# Altium schematic sheet P03_Processor 2 or 3, USB and Serial.SchDoc
size A
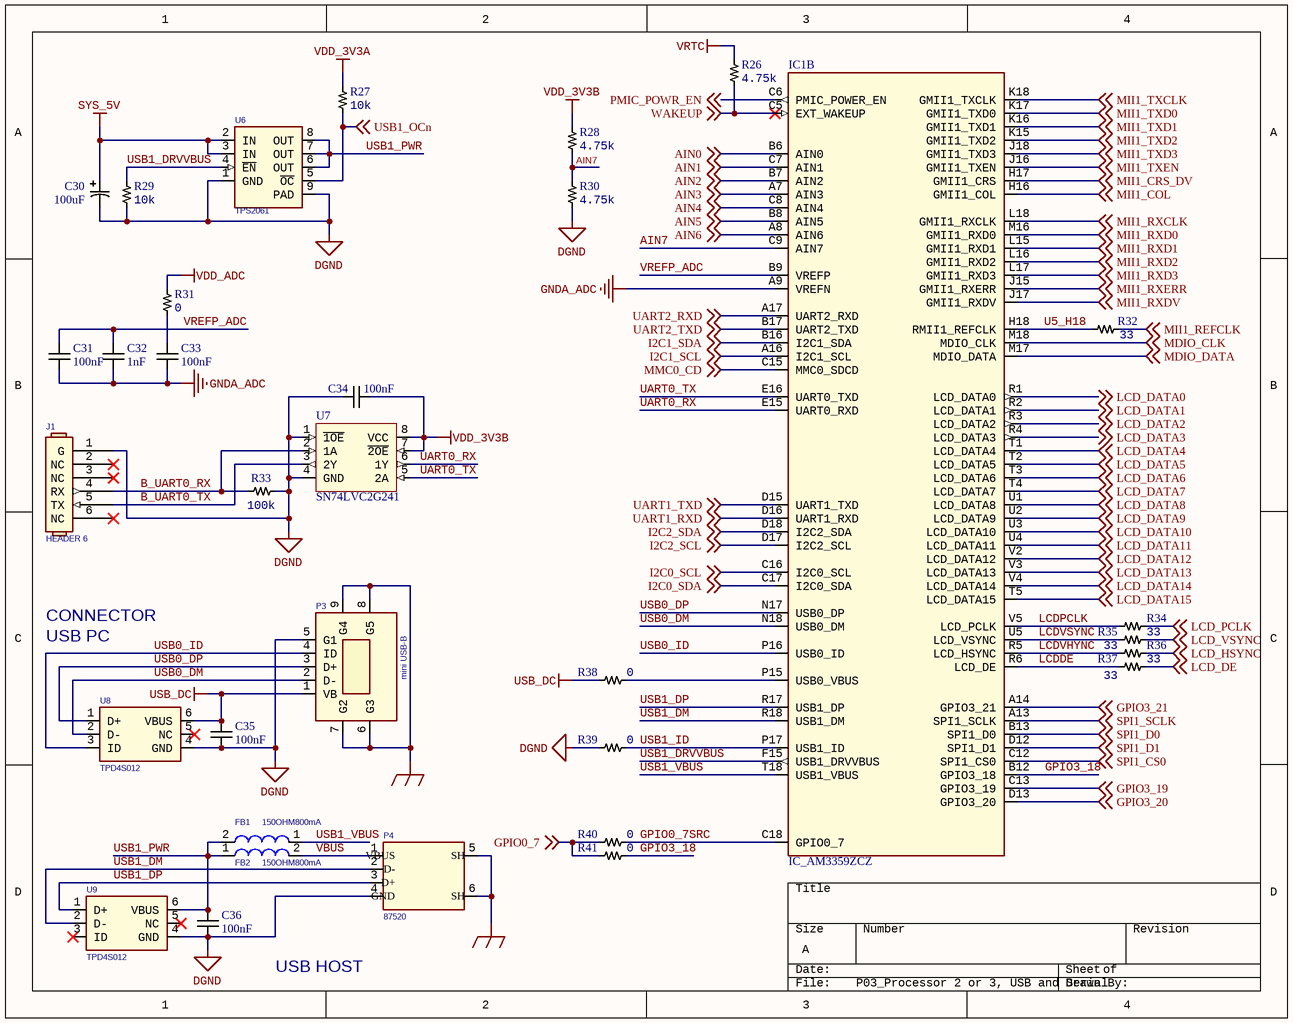
[diagram p0: P03_Processor 2 or 3, USB and Serial.SchDoc]

## Parts
C30  Capacitance: 100uF  [CAP6.6x6.6]  (hidden comment: EEE-0JA101SP)
C31  Capacitance: 100nF  [CAP0402]  (hidden comment: C0402C104K4RACTU)
C32  Capacitance: 1nF  [CAP0402]  (hidden comment: CC0402KRX7R9BB102)
C33  Capacitance: 100nF  [CAP0402]  (hidden comment: C0402C104K4RACTU)
C34  Capacitance: 100nF  [CAP0402]  (hidden comment: C0402C104K4RACTU)
C35  Capacitance: 100nF  [CAP0402]  (hidden comment: C0402C104K4RACTU)
C36  Capacitance: 100nF  [CAP0402]  (hidden comment: C0402C104K4RACTU)
FB1  150OHM800mA  [FB0805]
FB2  150OHM800mA  [FB0805]
IC1  IC_AM3359ZCZ  [BGA-324]  (part B of 5)
J1  HEADER 6  [SIP6]
P3  mini USB-B  [USB5MINI_4SHIELDED_SMD-5]
P4  87520  [USB_A]
R26  Resistance: 4.75k  [RES0402]  (hidden comment: RC0402FR-074K75L)
R27  Resistance: 10k  [RES0402]  (hidden comment: RC0402FR-0710KL)
R28  Resistance: 4.75k  [RES0402]  (hidden comment: RC0402FR-074K75L)
R29  Resistance: 10k  [RES0402]  (hidden comment: RC0402FR-0710KL)
R30  Resistance: 4.75k  [RES0402]  (hidden comment: RC0402FR-074K75L)
R31  Resistance: 0  [RES0402]  (hidden comment: RC0402JR-070RL)
R32  Resistance: 33  [RES0402]  (hidden comment: RC0402FR-0733RL)
R33  Resistance: 100k  [RES0402]  (hidden comment: RC0402FR-07100KL)
R34  Resistance: 33  [RES0402]  (hidden comment: RC0402FR-0733RL)
R35  Resistance: 33  [RES0402]  (hidden comment: RC0402FR-0733RL)
R36  Resistance: 33  [RES0402]  (hidden comment: RC0402FR-0733RL)
R37  Resistance: 33  [RES0402]  (hidden comment: RC0402FR-0733RL)
R38  Resistance: 0  [RES0402]  (hidden comment: RC0402JR-070RL)
R39  Resistance: 0  [RES0402]  (hidden comment: RC0402JR-070RL)
R40  Resistance: 0  [RES0402]  (hidden comment: RC0402JR-070RL)
R41  Resistance: 0  [RES0402]  (hidden comment: RC0402JR-070RL)
U6  TPS2061  [HVSSOP-8]
U7  SN74LVC2G241  [VSSOP-8]
U8  TPD4S012  [U_6_DRY]
U9  TPD4S012  [U_6_DRY]

## Nets
DGND: C30.2(C) C34.1 C35.2 C36.2 J1.1(G) P3.5(G1) P4.4(P4) R29.2 R30.1 R33.1 R39.1 U6.1(GND) U6.9(PAD) U7.1(~{1OE}) U7.4(GND) U8.4(GND) U9.4(GND)
GND_EARTH: P3.6(G3) P3.7(G2) P3.8(G5) P3.9(G4) P4.5(SHELD1) P4.6(PAD4)
GNDA_ADC: C31.2 C32.2 C33.2 IC1.A9(VREFN)
SYS_5V: C30.1(A) U6.2(IN) U6.3(IN)
USB_DC: C35.1 P3.1(VB) R38.1 U8.6(VBUS)
VDD_3V3A: R27.1
VDD_3V3B: C34.2 R28.2 U7.7(~{2OE}) U7.8(VCC)
VDD_ADC: R31.2
VRTC: R26.2
AIN0: IC1.B6(AIN0) ; off-sheet AIN0
AIN1: IC1.C7(AIN1) ; off-sheet AIN1
AIN2: IC1.B7(AIN2) ; off-sheet AIN2
AIN3: IC1.A7(AIN3) ; off-sheet AIN3
AIN4: IC1.C8(AIN4) ; off-sheet AIN4
AIN5: IC1.B8(AIN5) ; off-sheet AIN5
AIN6: IC1.A8(AIN6) ; off-sheet AIN6
AIN7: IC1.C9(AIN7) R28.1 R30.2
B_UART0_RX: J1.4(RX) R33.2 U7.2(1A)
B_UART0_TX: J1.5(TX) U7.3(2Y)
GPIO0_7: R40.2 R41.1 ; off-sheet GPIO0_7
GPIO0_7SRC: IC1.C18(GPIO0_7) R40.1
GPIO3_18: IC1.B12(GPIO3_18) R41.2
GPIO3_19: IC1.C13(GPIO3_19) ; off-sheet GPIO3_19
GPIO3_20: IC1.D13(GPIO3_20) ; off-sheet GPIO3_20
GPIO3_21: IC1.A14(GPIO3_21) ; off-sheet GPIO3_21
I2C0_SCL: IC1.C16(I2C0_SCL) ; off-sheet I2C0_SCL
I2C0_SDA: IC1.C17(I2C0_SDA) ; off-sheet I2C0_SDA
I2C1_SCL: IC1.A16(I2C1_SCL) ; off-sheet I2C1_SCL
I2C1_SDA: IC1.B16(I2C1_SDA) ; off-sheet I2C1_SDA
I2C2_SCL: IC1.D17(I2C2_SCL) ; off-sheet I2C2_SCL
I2C2_SDA: IC1.D18(I2C2_SDA) ; off-sheet I2C2_SDA
LCD_DATA0: IC1.R1(LCD_DATA0) ; off-sheet LCD_DATA0
LCD_DATA1: IC1.R2(LCD_DATA1) ; off-sheet LCD_DATA1
LCD_DATA2: IC1.R3(LCD_DATA2) ; off-sheet LCD_DATA2
LCD_DATA3: IC1.R4(LCD_DATA3) ; off-sheet LCD_DATA3
LCD_DATA4: IC1.T1(LCD_DATA4) ; off-sheet LCD_DATA4
LCD_DATA5: IC1.T2(LCD_DATA5) ; off-sheet LCD_DATA5
LCD_DATA6: IC1.T3(LCD_DATA6) ; off-sheet LCD_DATA6
LCD_DATA7: IC1.T4(LCD_DATA7) ; off-sheet LCD_DATA7
LCD_DATA8: IC1.U1(LCD_DATA8) ; off-sheet LCD_DATA8
LCD_DATA9: IC1.U2(LCD_DATA9) ; off-sheet LCD_DATA9
LCD_DATA10: IC1.U3(LCD_DATA10) ; off-sheet LCD_DATA10
LCD_DATA11: IC1.U4(LCD_DATA11) ; off-sheet LCD_DATA11
LCD_DATA12: IC1.V2(LCD_DATA12) ; off-sheet LCD_DATA12
LCD_DATA13: IC1.V3(LCD_DATA13) ; off-sheet LCD_DATA13
LCD_DATA14: IC1.V4(LCD_DATA14) ; off-sheet LCD_DATA14
LCD_DATA15: IC1.T5(LCD_DATA15) ; off-sheet LCD_DATA15
LCD_DE: R37.2 ; off-sheet LCD_DE
LCD_HSYNC: R36.2 ; off-sheet LCD_HSYNC
LCD_PCLK: R34.2 ; off-sheet LCD_PCLK
LCD_VSYNC: R35.2 ; off-sheet LCD_VSYNC
LCDDE: IC1.R6(LCD_DE) R37.1
LCDPCLK: IC1.V5(LCD_PCLK) R34.1
LCDVHYNC: IC1.R5(LCD_HSYNC) R36.1
LCDVSYNC: IC1.U5(LCD_VSYNC) R35.1
MDIO_CLK: IC1.M18(MDIO_CLK) ; off-sheet MDIO_CLK
MDIO_DATA: IC1.M17(MDIO_DATA) ; off-sheet MDIO_DATA
MII1_COL: IC1.H16(GMII1_COL) ; off-sheet MII1_COL
MII1_CRS_DV: IC1.H17(GMII1_CRS) ; off-sheet MII1_CRS_DV
MII1_REFCLK: R32.2 ; off-sheet MII1_REFCLK
MII1_RXCLK: IC1.L18(GMII1_RXCLK) ; off-sheet MII1_RXCLK
MII1_RXD0: IC1.M16(GMII1_RXD0) ; off-sheet MII1_RXD0
MII1_RXD1: IC1.L15(GMII1_RXD1) ; off-sheet MII1_RXD1
MII1_RXD2: IC1.L16(GMII1_RXD2) ; off-sheet MII1_RXD2
MII1_RXD3: IC1.L17(GMII1_RXD3) ; off-sheet MII1_RXD3
MII1_RXDV: IC1.J17(GMII1_RXDV) ; off-sheet MII1_RXDV
MII1_RXERR: IC1.J15(GMII1_RXERR) ; off-sheet MII1_RXERR
MII1_TXCLK: IC1.K18(GMII1_TXCLK) ; off-sheet MII1_TXCLK
MII1_TXD0: IC1.K17(GMII1_TXD0) ; off-sheet MII1_TXD0
MII1_TXD1: IC1.K16(GMII1_TXD1) ; off-sheet MII1_TXD1
MII1_TXD2: IC1.K15(GMII1_TXD2) ; off-sheet MII1_TXD2
MII1_TXD3: IC1.J18(GMII1_TXD3) ; off-sheet MII1_TXD3
MII1_TXEN: IC1.J16(GMII1_TXEN) ; off-sheet MII1_TXEN
MMC0_CD: IC1.C15(MMC0_SDCD) ; off-sheet MMC0_CD
PMIC_POWR_EN: IC1.C6(PMIC_POWER_EN) ; off-sheet PMIC_POWR_EN
SPI1_CS0: IC1.C12(SPI1_CS0) ; off-sheet SPI1_CS0
SPI1_D0: IC1.B13(SPI1_D0) ; off-sheet SPI1_D0
SPI1_D1: IC1.D12(SPI1_D1) ; off-sheet SPI1_D1
SPI1_SCLK: IC1.A13(SPI1_SCLK) ; off-sheet SPI1_SCLK
U5_H18: IC1.H18(RMII1_REFCLK) R32.1
UART0_RX: IC1.E15(UART0_RXD) U7.6(1Y)
UART0_TX: IC1.E16(UART0_TXD) U7.5(2A)
UART1_RXD: IC1.D16(UART1_RXD) ; off-sheet UART1_RXD
UART1_TXD: IC1.D15(UART1_TXD) ; off-sheet UART1_TXD
UART2_RXD: IC1.A17(UART2_RXD) ; off-sheet UART2_RXD
UART2_TXD: IC1.B17(UART2_TXD) ; off-sheet UART2_TXD
USB0_DM: IC1.N18(USB0_DM) P3.2(D-) U8.2(D-)
USB0_DP: IC1.N17(USB0_DP) P3.3(D+) U8.1(D+)
USB0_ID: IC1.P16(USB0_ID) P3.4(ID) U8.3(ID)
USB1_DM: IC1.R18(USB1_DM) P4.2(P2) U9.2(D-)
USB1_DP: IC1.R17(USB1_DP) P4.3(P3) U9.1(D+)
USB1_DRVVBUS: IC1.F15(USB1_DRVVBUS) R29.1 U6.4(~{EN})
USB1_ID: IC1.P17(USB1_ID) R39.2
USB1_OCn: R27.2 U6.5(~{OC}) ; off-sheet USB1_OCn
USB1_PWR: C36.1 FB1.2 FB2.1 U6.6(OUT) U6.7(OUT) U6.8(OUT) U9.6(VBUS)
USB1_VBUS: FB1.1 IC1.T18(USB1_VBUS)
VBUS: FB2.2 P4.1(P1)
VREFP_ADC: C31.1 C32.1 IC1.B9(VREFP)
WAKEUP: IC1.C5(EXT_WAKEUP) R26.1 ; off-sheet WAKEUP
NetC33_1: C33.1 R31.1
NetIC1_P15: IC1.P15(USB0_VBUS) R38.2

Not connected (* = marked no-connect by the designer): J1 2(NC)* 3(NC)* 6(NC)*; U8 5(NC)*; U9 3(ID)* 5(NC)*

## Notes on the sheet
- USB PC
- CONNECTOR
- USB HOST
- Title
- Size:
- Date:
- A
- Number:
- Time:
- Revision:
- Sheet
- of
- File:
- (in symbol CONN_USBA) VBUS; SH; D-; D+; GND

## Library data of the parts
C30 = CAP_POL_100uF: POL CAP 100uF SMD; Manufacturer: Panasonic; Dielectric Material: Aluminium; Ripple Current: 71mA; Tolerance: 20%; Voltage Rating: 6.3V; Life (Hours): 2000Hour; Leakage Current: 3uA; Lead Length: 2.6mm; Supplier 1: Digi-Key; Manufacturer Part Number: EEE-0JA101SP; Stock 1: 67789; Pricing 1: 1=0.35000, 10=0.24000, 100=0.14420, 500=0.10816 (USD); RoHS: Yes; Mount: Surface Mount,PCB; Case/Package: Radial; Number of Pins: 2; Contact Plating: Tin; Min Operating Temperature: -40°C; Max Operating Temperature: 85°C; Ripple Current (AC): 71mA; Packaging: Tape and Reel; Voltage Rating (DC): 6.3V; Package Quantity: 1; Termination: SMD/SMT; Voltage: 6.3V; Features: General Purpose; Diameter: 6.3mm; Length: 5.5mm; Height: 5.4mm; Height - Seated (Max): 0.213inch; Width: 6.6mm; Lead Pitch: 2.2mm; Radiation Hardening: No; REACH SVHC: No SVHC; Lead Free: Lead Free; ComponentLink1URL: https://datasheet.ciiva.com/11779/0900766b8078636e-11779744.pdf?src-supplier=RSComponents; ComponentLink1Description: https://datasheet.ciiva.com/11779/0900766b8078636e-11779744.pdf?src-supplier=RSComponents; ComponentLink2URL: https://datasheet.ciiva.com/14610/70255710-14610022.pdf?src-supplier=Allied+Electronics; ComponentLink2Description: https://datasheet.ciiva.com/14610/70255710-14610022.pdf?src-supplier=Allied+Electronics; ComponentLink3URL: https://datasheet.ciiva.com/30226/11aba0000ce2-30226184.pdf?src-supplier=Onlinecomponents.com; ComponentLink3Description: https://datasheet.ciiva.com/30226/11aba0000ce2-30226184.pdf?src-supplier=Onlinecomponents.com; ComponentLink4URL: https://datasheet.ciiva.com/16397/aba0000ce2-16397066.pdf?src-supplier=Future+Electronics; ComponentLink4Description: https://datasheet.ciiva.com/16397/aba0000ce2-16397066.pdf?src-supplier=Future+Electronics; ComponentLink5URL: https://datasheet.ciiva.com/46387/aba0000ce2-46387964.pdf?src-supplier=Element14; ComponentLink5Description: https://datasheet.ciiva.com/46387/aba0000ce2-46387964.pdf?src-supplier=Element14; ComponentLink6URL: https://datasheet.ciiva.com/14595/70255710-14595757.pdf?src-supplier=Allied+Electronics; ComponentLink6Description: https://datasheet.ciiva.com/14595/70255710-14595757.pdf?src-supplier=Allied+Electronics; ComponentLink7URL: https://datasheet.ciiva.com/2983/aba0000ce2-2983902.pdf?src-supplier=Avnet; ComponentLink7Description: https://datasheet.ciiva.com/2983/aba0000ce2-2983902.pdf?src-supplier=Avnet; ComponentLink8URL: https://datasheet.ciiva.com/43485/aba0000ce2-43485605.pdf?src-supplier=Farnell; ComponentLink8Description: https://datasheet.ciiva.com/43485/aba0000ce2-43485605.pdf?src-supplier=Farnell; ComponentLink9URL: https://datasheet.ciiva.com/24070/aba0000ce2-40801-24070230.pdf?src-supplier=Mouser; ComponentLink9Description: https://datasheet.ciiva.com/24070/aba0000ce2-40801-24070230.pdf?src-supplier=Mouser; ComponentLink10URL: https://datasheet.ciiva.com/46376/aba0000ce2-46376375.pdf?src-supplier=Element14; ComponentLink10Description: https://datasheet.ciiva.com/46376/aba0000ce2-46376375.pdf?src-supplier=Element14; ComponentLink11URL: https://datasheet.ciiva.com/6134/aba0000ce2-6134361.pdf?src-supplier=Farnell; ComponentLink11Description: https://datasheet.ciiva.com/6134/aba0000ce2-6134361.pdf?src-supplier=Farnell; ComponentLink12URL: https://datasheet.ciiva.com/16539/aba0000ce2-16539929.pdf?src-supplier=Avnet+Asia; ComponentLink12Description: https://datasheet.ciiva.com/16539/aba0000ce2-16539929.pdf?src-supplier=Avnet+Asia; ComponentLink13URL: https://datasheet.ciiva.com/15165/getdatasheetpartid-73778-15165850.pdf?src-supplier=Verical; ComponentLink13Description: https://datasheet.ciiva.com/15165/getdatasheetpartid-73778-15165850.pdf?src-supplier=Verical; ComponentLink14URL: https://datasheet.ciiva.com/17353/aba0000ce2-17353295.pdf?src-supplier=Avnet+Europe; ComponentLink14Description: https://datasheet.ciiva.com/17353/aba0000ce2-17353295.pdf?src-supplier=Avnet+Europe; Supplier Part Number 1: PCE3852CT-ND
C31 C33-C36 = CAP_100nF: MLCC 100nF 0402 SMD; Manufacturer: KEMET; Tolerance: 10%; Voltage Rating (DC): 16V; Dielectric: X7R; Dissipation Factor: 3.5%; Supplier 1: Digi-Key; Supplier Part Number 1: 399-3521-1-ND; Manufacturer Part Number: C0402C104K4RACTU; RoHS: Yes; Stock 1: 6512243; Pricing 1: 1=0.10000, 10=0.04200, 100=0.01860, 500=0.01328, 1000=0.01044, 2500=0.00949, 5000=0.00873 (USD); Packaging: Tape and Reel; Mount: Surface Mount; Case/Package: 0402; Case Code (Imperial): 0402; Case Code (Metric): 1005; Contact Plating: Tin,Matte; Min Operating Temperature: -55°C; Max Operating Temperature: 125°C; Package Quantity: 10000; Voltage Rating: 16V; Termination: SMD/SMT; Length: 1mm; Height: 0.5mm; Width: 0.5mm; Depth: 0.5mm; Radiation Hardening: No; ComponentLink2URL: https://datasheet.ciiva.com/18192/getdatasheetpartid-385384-18192412.pdf?src-supplier=Verical; ComponentLink2Description: Datasheet
C32 = CAP_1nF: MLCC 1nF 0402 SMD; Manufacturer: Yageo; Tolerance: 10%; Dielectric Material: Ceramic; Voltage Rating: 50V; Insulation Resistance: 100GR; Supplier 1: Digi-Key; Manufacturer Part Number: CC0402KRX7R9BB102; RoHS: Yes; Stock 1: 3539064; Pricing 1: 1=0.10000, 10=0.02100, 100=0.00920, 500=0.00654, 1000=0.00514, 2500=0.00468, 5000=0.00430 (USD); Packaging: Tape and Reel; ComponentLink1URL: https://datasheet.ciiva.com/11786/0900766b8079c870-11786157.pdf?src-supplier=RSComponents; ComponentLink1Description: https://datasheet.ciiva.com/11786/0900766b8079c870-11786157.pdf?src-supplier=RSComponents; Mount: Surface Mount; Case/Package: 0402; Case Code (Metric): 1005; Case Code (Imperial): 0402; Min Operating Temperature: -55°C; Max Operating Temperature: 125°C; Length: 0.039inch; Width: 0.02inch; Thickness: 0.022inch; Lead Free: Lead Free; Halogen Free: Halogen Free; ComponentLink2URL: https://datasheet.ciiva.com/143/mlccorderingcode-143956.pdf?src-supplier=Digi-Key; ComponentLink2Description: https://datasheet.ciiva.com/143/mlccorderingcode-143956.pdf?src-supplier=Digi-Key; ComponentLink3URL: https://datasheet.ciiva.com/143/mlccorderingcode-143957.pdf?src-supplier=Digi-Key; ComponentLink3Description: https://datasheet.ciiva.com/143/mlccorderingcode-143957.pdf?src-supplier=Digi-Key; ComponentLink4URL: https://datasheet.ciiva.com/143/mlccorderingcode-143958.pdf?src-supplier=Digi-Key; ComponentLink4Description: https://datasheet.ciiva.com/143/mlccorderingcode-143958.pdf?src-supplier=Digi-Key; ComponentLink5URL: https://datasheet.ciiva.com/13389/upy-gp-np0-16v-to-50v-8-13389974.pdf?src-supplier=Mouser; ComponentLink5Description: https://datasheet.ciiva.com/13389/upy-gp-np0-16v-to-50v-8-13389974.pdf?src-supplier=Mouser; ComponentLink6URL: https://datasheet.ciiva.com/16625/upy-gphc-x7r-6-3v-to-50v-8-16625512.pdf?src-supplier=Avnet+Europe; ComponentLink6Description: https://datasheet.ciiva.com/16625/upy-gphc-x7r-6-3v-to-50v-8-16625512.pdf?src-supplier=Avnet+Europe; ComponentLink7URL: https://datasheet.ciiva.com/15189/getdatasheetpartid-403474-15189131.pdf?src-supplier=Verical; ComponentLink7Description: https://datasheet.ciiva.com/15189/getdatasheetpartid-403474-15189131.pdf?src-supplier=Verical; ComponentLink8URL: https://datasheet.ciiva.com/7978/1489800-7978092.pdf?src-supplier=Element14; ComponentLink8Description: https://datasheet.ciiva.com/7978/1489800-7978092.pdf?src-supplier=Element14; ComponentLink9URL: https://datasheet.ciiva.com/22749/1489800-22749213.pdf?src-supplier=Element14; ComponentLink9Description: https://datasheet.ciiva.com/22749/1489800-22749213.pdf?src-supplier=Element14
FB1 = FERR: FERRITE 800MA 150 OHM 0805 SMD; Manufacturer: Laird-Signal Integrity Products; Manufacturer Part Number: LI0805H151R-10; PartName: FerriteBead150ohm800mA; Mfr: Steward; TIIntPartnumber: 1L0010; Vendor: Digikey; Impedance @ Frequency: 150 Ohm @ 100MHz; DC Resistance (DCR): 150 mOhm Max; Filter Type: Differential Mode - Single; Supplier 1: Digi-Key; Supplier Part Number 1: 240-2384-6-ND; RoHS: RoHS Compliant; Category: Filters; Stock 1: 3694; Pricing 1: 1=0.1, 10=0.07, 25=0.064, 50=0.0574, 100=0.0421, 250=0.03064, 500=0.02808, 1000=0.02424 (USD); Package / Case: 0805 (2012 Metric); Size / Dimension: 0.079" L x 0.049" W (2.00mm x 1.25mm); Packaging: Digi-Reel®; ComponentLink1URL: http://www.lairdtech.com/WorkArea/linkit.aspx?LinkIdentifier=id&ItemID=4912; ComponentLink1Description: http://www.lairdtech.com/WorkArea/linkit.aspx?LinkIdentifier=id&ItemID=4912; MfrNum: LI0805H151R-10; Current Rating: 800mA; Mounting Type: Surface Mount; Height (Max): 0.043" (1.10mm)
FB2 = FERR: FERRITE 800MA 150 OHM 0805 SMD; PartName: FerriteBead150ohm800mA; Mfr: Steward; MfrNum: LI0805H151R-10; TIIntPartnumber: 1L0010; Manufacturer: Laird-Signal Integrity Products; Vendor: Digikey; Impedance @ Frequency: 150 Ohm @ 100MHz; DC Resistance (DCR): 150 mOhm Max; Filter Type: Differential Mode - Single; Supplier 1: Digi-Key; Supplier Part Number 1: 240-2384-6-ND; Manufacturer Part Number: LI0805H151R-10; RoHS: RoHS Compliant; Category: Filters; Stock 1: 3694; Pricing 1: 1=0.1, 10=0.07, 25=0.064, 50=0.0574, 100=0.0421, 250=0.03064, 500=0.02808, 1000=0.02424 (USD); Current Rating: 800mA; Package / Case: 0805 (2012 Metric); Mounting Type: Surface Mount; Packaging: Digi-Reel®; Height (Max): 0.043" (1.10mm); Size / Dimension: 0.079" L x 0.049" W (2.00mm x 1.25mm); ComponentLink1URL: http://www.lairdtech.com/WorkArea/linkit.aspx?LinkIdentifier=id&ItemID=4912; ComponentLink1Description: http://www.lairdtech.com/WorkArea/linkit.aspx?LinkIdentifier=id&ItemID=4912
IC1 = IC_AM335X_ZCE_1: SubArctic Cortex A8 Processor 18x18; Manufacturer: Texas Instruments; Manufacturer Part Number: XAM3359ZCZ; Processor Type: ARM Microprocessor; Voltage: 1.06 V ~ 1.15 V; Supplier 1: Digi-Key; Supplier Part Number 1: 296-35073-ND; RoHS: RoHS Compliant; Category: Integrated Circuits (ICs); Stock 1: 16; Pricing 1: 1=33.5, 10=30.988, 100=26.465, 250=24.28752, 500=23.115, 1000=21.775, 2500=21.105, 5000=20.6025, 10000=20.1 (USD); Features: -; Speed: -; Mounting Type: Surface Mount; Package / Case: 324-LFBGA; Supplier Device Package: 324-NFBGA(15x15); Packaging: Tray; ComponentLink1URL: http://www.ti.com/lit/ds/symlink/am3354.pdf; ComponentLink1Description: http://www.ti.com/lit/ds/symlink/am3354.pdf
J1 = HDR_6x1: CONN HEADER 6POS, VERTICAL,  .100 STR TIN; Manufacturer: Samtec Inc; Manufacturer Part Number: FTR-110-03-G-D-06; Connector Type: Unshrouded; Number of Positions: 20; Number of Positions Loaded: 19; Pitch: 0.050" (1.27mm); Row Spacing: 0.100" (2.54mm); Supplier 1: Digi-Key; Supplier Part Number 1: FTR-110-03-G-D-06-ND; RoHS: RoHS Compliant; Category: Connectors, Interconnects; Stock 1: 0; Pricing 1: 1=4.47 (USD); Number of Rows: 2; Contact Mating Length: 0.125" (3.18mm); Mounting Type: Surface Mount; Termination: Solder; Features: -; Contact Finish: Gold; Contact Finish Thickness: 10µin (0.25µm); Color: Black; Packaging: Tube; ComponentLink1URL: http://www.samtec.com/documents/webfiles/cpdf/FTR-1XX-XX-XX-D-X-XX-MKT.pdf; ComponentLink1Description: http://www.samtec.com/documents/webfiles/cpdf/FTR-1XX-XX-XX-D-X-XX-MKT.pdf; Height Stacking (Mating): -; Molding Height Above Board: 0.100" (2.54mm)
P3 = MINI-USB-AB-SOCKET: CONN RCPT USB MINI B R/A SMD; Manufacturer: KYCON; Manufacturer Part Number: 0565790576; Order# 2: C-440247; ATLStockNo1: 4500.0223; Order#: KMAB-SMT-5S-S-30TR; Connector Type: USB - mini AB; Number of Contacts: 5; Gender: Receptacle; Specifications: USB 2.0 OTG; Manufacturer 2: AMP; Distributor: Deltron; Distributor 2: Tyco; Supplier 1: Digi-Key; Supplier Part Number 1: WM17122DKR-ND; RoHS: RoHS Compliant; Category: Connectors, Interconnects; Stock 1: 12426; Pricing 1: 1=2.92, 10=2.649, 25=2.4872, 50=2.3792, 100=2.271, 250=2.05468 (USD); Mounting Type: Surface Mount, Right Angle, Horizontal; Features: Shielded; Packaging: Digi-Reel®; Ingress Protection: -; ComponentLink1URL: http://www.molex.com/pdm_docs/sd/565790576_sd.pdf; ComponentLink1Description: http://www.molex.com/pdm_docs/sd/565790576_sd.pdf
P4 = CONN_USBA: CONN RCPT USB TYPE A R/A PCB; Manufacturer: FCI; Manufacturer Part Number: 87520-0010BLF; CLASS: IO; TN: 224-0234-000; Connector Type: USB - A; Number of Contacts: 4; Gender: Receptacle; Specifications: USB 2.0; Supplier 1: Digi-Key; Supplier Part Number 1: 609-1045-ND; RoHS: RoHS Compliant; Category: Connectors, Interconnects; Stock 1: 4363; Pricing 1: 1=0.78, 10=0.734, 25=0.6604, 50=0.587, 100=0.5626, 250=0.51368, 500=0.4892, 1000=0.40359, 2500=0.3669 (USD); Mounting Type: Through Hole, Right Angle, Horizontal; Features: Board Lock; Packaging: Tube; Ingress Protection: -; ComponentLink1URL: http://portal.fciconnect.com/Comergent//fci/drawing/87520.pdf; ComponentLink1Description: http://portal.fciconnect.com/Comergent//fci/drawing/87520.pdf
R26 R28 R30 = RES_4.75k: Resistor 4.75kOhm 0402 SMD; Manufacturer: Yageo; Temperature Coefficient: 100ppm/°C; Tolerance: 1%; Voltage Rating: 50V; Power Rating: 62.5mW; Max Power Dissipation: 63mW; Supplier 1: Digi-Key; Manufacturer Part Number: RC0402FR-074K75L; RoHS: Yes; Stock 1: 9368381; Pricing 1: 1=0.10000, 10=0.01600, 100=0.00640, 1000=0.00289, 2500=0.00251, 5000=0.00207 (USD); Composition: Thick Film; Features: Moisture Resistant; Height: 0.016inch; Number of Terminations: 2; Packaging: Tape and Reel; ComponentLink1URL: https://datasheet.ciiva.com/11808/0900766b80c66297-11808814.pdf?src-supplier=RSComponents; ComponentLink1Description: https://datasheet.ciiva.com/11808/0900766b80c66297-11808814.pdf?src-supplier=RSComponents; Case/Package: 0402; Case Code (Imperial): 0402; Case Code (Metric): 1005; Min Operating Temperature: -55°C; Max Operating Temperature: 155°C; Package Quantity: 1; Termination: SMD/SMT; Military Standard: Not; Voltage Rating (DC): 50V; Working Voltage: 50V; Length: 1mm; Width: 0.5mm; Depth: 0.5mm; REACH SVHC: No SVHC; Lead Free: Lead Free; ComponentLink2URL: https://datasheet.ciiva.com/15189/getdatasheetpartid-326465-15189478.pdf?src-supplier=Verical; ComponentLink2Description: https://datasheet.ciiva.com/15189/getdatasheetpartid-326465-15189478.pdf?src-supplier=Verical; ComponentLink3URL: https://datasheet.ciiva.com/2553/pyu-r-int-thick-7-2553224.pdf?src-supplier=Digi-Key; ComponentLink3Description: https://datasheet.ciiva.com/2553/pyu-r-int-thick-7-2553224.pdf?src-supplier=Digi-Key; ComponentLink4URL: https://datasheet.ciiva.com/7983/1018594-7983544.pdf?src-supplier=Element14; ComponentLink4Description: https://datasheet.ciiva.com/7983/1018594-7983544.pdf?src-supplier=Element14; ComponentLink5URL: https://datasheet.ciiva.com/2553/pyu-r-int-thick-7-2553225.pdf?src-supplier=Digi-Key; ComponentLink5Description: https://datasheet.ciiva.com/2553/pyu-r-int-thick-7-2553225.pdf?src-supplier=Digi-Key; ComponentLink6URL: https://datasheet.ciiva.com/2553/pyu-r-int-thick-7-2553226.pdf?src-supplier=Digi-Key; ComponentLink6Description: https://datasheet.ciiva.com/2553/pyu-r-int-thick-7-2553226.pdf?src-supplier=Digi-Key; ComponentLink7URL: https://datasheet.ciiva.com/16744/pyu-rc0402-51-rohs-l-6-r-16744524.pdf?src-supplier=Future+Electronics; ComponentLink7Description: https://datasheet.ciiva.com/16744/pyu-rc0402-51-rohs-l-6-r-16744524.pdf?src-supplier=Future+Electronics
R27 R29 = RES_10k: Resistor 10kOhm 0402 SMD; Manufacturer: Yageo; Temperature Coefficient: 100ppm/°C; Tolerance: 1%; Voltage Rating (DC): 50V; Power Rating: 62.5mW; Supplier 1: Digi-Key; Manufacturer Part Number: RC0402FR-0710KL; RoHS: Yes; Stock 1: 72891652; Pricing 1: 1=0.10000, 10=0.01500, 100=0.00600, 1000=0.00270, 2500=0.00235, 5000=0.00194 (USD); Composition: Thick Film; Height: 0.32mm; Number of Terminations: 2; Packaging: Tape and Reel; ComponentLink1URL: https://datasheet.ciiva.com/7660/38568-7660787.pdf?src-supplier=Element14; ComponentLink1Description: https://datasheet.ciiva.com/7660/38568-7660787.pdf?src-supplier=Element14; Case/Package: 0402; Number of Pins: 2; Case Code (Imperial): 0402; Case Code (Metric): 1005; Min Operating Temperature: -55°C; Max Operating Temperature: 155°C; Voltage Rating: 50V; Termination: SMD/SMT; Military Standard: Not; Working Voltage: 50V; Length: 1mm; Width: 0.5mm; Depth: 0.5mm; Lead Pitch: 0.2mm; REACH SVHC: No SVHC; Lead Free: Lead Free; ComponentLink2URL: https://datasheet.ciiva.com/7983/1018594-7983486.pdf?src-supplier=Element14; ComponentLink2Description: https://datasheet.ciiva.com/7983/1018594-7983486.pdf?src-supplier=Element14; ComponentLink3URL: https://datasheet.ciiva.com/7849/1784430-7849813.pdf?src-supplier=Element14; ComponentLink3Description: https://datasheet.ciiva.com/7849/1784430-7849813.pdf?src-supplier=Element14; ComponentLink4URL: https://datasheet.ciiva.com/7849/1686128-7849814.pdf?src-supplier=Element14; ComponentLink4Description: https://datasheet.ciiva.com/7849/1686128-7849814.pdf?src-supplier=Element14; ComponentLink5URL: https://datasheet.ciiva.com/7849/1784430-7849815.pdf?src-supplier=Element14; ComponentLink5Description: https://datasheet.ciiva.com/7849/1784430-7849815.pdf?src-supplier=Element14; ComponentLink6URL: https://datasheet.ciiva.com/22747/1018594-22747512.pdf?src-supplier=Element14; ComponentLink6Description: https://datasheet.ciiva.com/22747/1018594-22747512.pdf?src-supplier=Element14; ComponentLink7URL: https://datasheet.ciiva.com/12667/pyu-rc0402-51-rohs-l-6-r-12667067.pdf?src-supplier=Mouser; ComponentLink7Description: https://datasheet.ciiva.com/12667/pyu-rc0402-51-rohs-l-6-r-12667067.pdf?src-supplier=Mouser
R31 R38 R39 R41 = RES_0: Resistor 0Ohm 0402 SMD; Manufacturer: Yageo; Power Rating: 62.5mW; Tolerance: 5%; Voltage Rating: 50V; Temperature Coefficient: 200ppm/°C; Max Power Dissipation: 63mW; Supplier 1: Digi-Key; Manufacturer Part Number: RC0402JR-070RL; Stock 1: 68160806; Pricing 1: 1=0.10000, 10=0.01300, 25=0.00920, 50=0.00700, 100=0.00510, 250=0.00392, 500=0.00312, 1000=0.00230, 5000=0.00165 (USD); RoHS: Yes; Case/Package: 0402; Contact Plating: Tin,Matte; Case Code (Metric): 1005; Case Code (Imperial): 0402; Min Operating Temperature: -55°C; Max Operating Temperature: 155°C; Composition: Thick Film; Packaging: Tape and Reel; Termination: SMD/SMT; Package Quantity: 1; Number of Terminations: 2; Military Standard: Not; Features: Moisture Resistant; Length: 1mm; Height: 0.016inch; Width: 0.02inch; Depth: 0.5mm; Radiation Hardening: No; Lead Free: Lead Free; REACH SVHC: Unknown; Supplier Part Number 1: 311-0.0JRCT-ND; ComponentLink1Description: Digikey; ComponentLink1URL: https://www.digikey.com/product-detail/en/yageo/RC0402JR-070RL/311-0.0JRCT-ND/729353; ComponentLink2Description: Datasheet; ComponentLink2URL: https://www.yageo.com/upload/media/product/productsearch/datasheet/rchip/PYu-RC_Group_51_RoHS_L_10.pdf
R32 R34-R37 = RES_33: Resistor 33Ohm 0402 SMD; Manufacturer: Yageo; Power Rating: 62.5mW; Tolerance: 1%; Voltage Rating: 50V; Temperature Coefficient: 100ppm/°C; Supplier 1: Digi-Key; Manufacturer Part Number: RC0402FR-0733RL; Stock 1: 5631148; Pricing 1: 1=0.10000, 10=0.01600, 100=0.00640, 1000=0.00289, 2500=0.00251, 5000=0.00207 (USD); RoHS: Yes; Case/Package: 0402; Number of Pins: 2; Case Code (Imperial): 0402; Case Code (Metric): 1005; Min Operating Temperature: -55°C; Max Operating Temperature: 155°C; Composition: Thick Film; Packaging: Tape and Reel; Voltage Rating (DC): 50V; Package Quantity: 10000; Termination: SMD/SMT; Military Standard: Not; Length: 1mm; Height: 0.35mm; Width: 0.5mm; Depth: 0.5mm; REACH SVHC: Unknown; Lead Free: Lead Free; ComponentLink1URL: https://datasheet.ciiva.com/11819/0900766b80c66297-11819487.pdf?src-supplier=RSComponents; ComponentLink1Description: https://datasheet.ciiva.com/11819/0900766b80c66297-11819487.pdf?src-supplier=RSComponents; ComponentLink2URL: https://datasheet.ciiva.com/15189/getdatasheetpartid-329253-15189431.pdf?src-supplier=Verical; ComponentLink2Description: https://datasheet.ciiva.com/15189/getdatasheetpartid-329253-15189431.pdf?src-supplier=Verical; ComponentLink3URL: https://datasheet.ciiva.com/24070/pyu-rc0402-51-rohs-l-6-r-8721-24070077.pdf?src-supplier=Mouser; ComponentLink3Description: https://datasheet.ciiva.com/24070/pyu-rc0402-51-rohs-l-6-r-8721-24070077.pdf?src-supplier=Mouser; ComponentLink4URL: https://datasheet.ciiva.com/7849/1018594-7849966.pdf?src-supplier=Element14; ComponentLink4Description: https://datasheet.ciiva.com/7849/1018594-7849966.pdf?src-supplier=Element14; ComponentLink5URL: https://datasheet.ciiva.com/7849/1018594-7849967.pdf?src-supplier=Element14; ComponentLink5Description: https://datasheet.ciiva.com/7849/1018594-7849967.pdf?src-supplier=Element14; ComponentLink6URL: https://datasheet.ciiva.com/17070/pyu-rc0402-51-rohs-l-6-r-17070335.pdf?src-supplier=Future+Electronics; ComponentLink6Description: https://datasheet.ciiva.com/17070/pyu-rc0402-51-rohs-l-6-r-17070335.pdf?src-supplier=Future+Electronics
R33 = RES_100k: Resistor 100kOhm 0402 SMD; Manufacturer: Yageo; Tolerance: 1%; Temperature Coefficient: 100ppm/°C; Power Rating: 63mW; Voltage Rating: 50V; Manufacturer Part Number: RC0402FR-07100KL; RoHS: Yes; Case/Package: 0402; Case Code (Metric): 1005; Case Code (Imperial): 0402; Min Operating Temperature: -55°C; Max Operating Temperature: 155°C; Composition: Thick Film; Packaging: Tape and Reel; Package Quantity: 1; Number of Terminations: 2; Termination: SMD/SMT; Military Standard: Not; Max Power Dissipation: 63mW; Working Voltage: 50V; Features: Moisture Resistant; Length: 0.039inch; Height: 0.016inch; Width: 0.02inch; Depth: 0.5mm; REACH SVHC: No SVHC; Lead Free: Lead Free; ComponentLink2Description: Datasheet; ComponentLink2URL: https://www.yageo.com/upload/media/product/productsearch/datasheet/rchip/PYu-RC_Group_51_RoHS_L_10.pdf; Supplier 1: Mouser; Supplier 2: Digi-Key; Supplier Part Number 1: 603-RC0402FR-07100KL; Supplier Part Number 2: 311-100KLRCT-ND
R40 = RES_0: Resistor 0Ohm 0402 SMD; Manufacturer: Yageo; Temperature Coefficient: 200ppm/°C; Tolerance: 5%; Power Rating: 62.5mW; Voltage Rating: 50V; Max Power Dissipation: 63mW; ComponentLink1Description: Digikey; ComponentLink1URL: https://www.digikey.com/product-detail/en/yageo/RC0402JR-070RL/311-0.0JRCT-ND/729353; Composition: Thick Film; Features: Moisture Resistant; Height: 0.016inch; Manufacturer Part Number: RC0402JR-070RL; Number of Terminations: 2; Packaging: Tape and Reel; Pricing 1: 1=0.10000, 10=0.01300, 25=0.00920, 50=0.00700, 100=0.00510, 250=0.00392, 500=0.00312, 1000=0.00230, 5000=0.00165 (USD); RoHS: Yes; Stock 1: 68160806; Supplier 1: Digi-Key; Supplier Part Number 1: 311-0.0JRCT-ND; Case/Package: 0402; Contact Plating: Tin,Matte; Case Code (Metric): 1005; Case Code (Imperial): 0402; Min Operating Temperature: -55°C; Max Operating Temperature: 155°C; Termination: SMD/SMT; Package Quantity: 1; Military Standard: Not; Length: 1mm; Width: 0.02inch; Depth: 0.5mm; Radiation Hardening: No; Lead Free: Lead Free; REACH SVHC: Unknown; ComponentLink2Description: Datasheet; ComponentLink2URL: https://www.yageo.com/upload/media/product/productsearch/datasheet/rchip/PYu-RC_Group_51_RoHS_L_10.pdf
U6 = TPS2061: IC 1.5A PWR DIST SWITCH 8-SOIC; Manufacturer: Texas Instruments; Manufacturer Part Number: TPS2051BDGNR; Number of Outputs: 1; Rds (On): 135 mOhm; Internal Switch(s): Yes; Current Limit: 1A; Voltage - Input: 2.7 V ~ 5.5 V; Supplier 1: Digi-Key; Supplier Part Number 1: 296-17313-6-ND; RoHS: RoHS Compliant; Category: Integrated Circuits (ICs); Stock 1: 7065; Pricing 1: 1=1.82, 10=1.642, 25=1.4708, 100=1.3224, 250=1.1742, 500=1.026, 1000=0.8493 (USD); Type: High Side Switch; Operating Temperature: -40°C ~ 85°C; Mounting Type: Surface Mount; Package / Case: 8-TSSOP, 8-MSOP (0.118", 3.00mm Width) Exposed Pad; Supplier Device Package: 8-MSOP-PowerPad; Packaging: Digi-Reel®; ComponentLink1URL: http://www.ti.com/lit/ds/symlink/tps2061.pdf; ComponentLink1Description: Datasheet
U7 = SN74LVC2G241: IC BUFF/DVR TRI-ST DL 8VSSOP; Manufacturer: Texas Instruments; Manufacturer Part Number: SN74LVC2G241DCUR; Logic Type: Buffer/Line Driver, Non-Inverting; Number of Elements: 2; Number of Bits per Element: 1; Current - Output High, Low: 32mA, 32mA; Voltage - Supply: 1.65 V ~ 5.5 V; Supplier 1: Digi-Key; Supplier Part Number 1: 296-11936-6-ND; RoHS: RoHS Compliant; Category: Integrated Circuits (ICs); Stock 1: 28602; Pricing 1: 1=0.49, 10=0.428, 25=0.3756 (USD); Operating Temperature: -40°C ~ 85°C; Mounting Type: Surface Mount; Package / Case: 8-VFSOP (0.091", 2.30mm Width); Supplier Device Package: US8; Packaging: Digi-Reel®; ComponentLink1URL: http://www.ti.com/lit/ds/symlink/sn74lvc2g241.pdf; ComponentLink1Description: http://www.ti.com/lit/ds/symlink/sn74lvc2g241.pdf
U8 U9 = PROT_TPD4S012: ESD 4channel USB Interface; Mfr: TI; MfrNum: TPD4S012DRY; TIIntPartnumber: 1A0233; Manufacturer: Texas Instruments; Manufacturer Part Number: TPD4S012DRYR; Vendor: Digikey; Cost100: 0.76; Cost10K: 0.23; Power (Watts): 60W; Number of Circuits: 4; PartName: TPD4S012; Supplier 1: Digi-Key; Supplier Part Number 1: 296-24244-6-ND; RoHS: RoHS Compliant; Category: Circuit Protection; Stock 1: 7978; Pricing 1: 1=0.78, 10=0.682, 25=0.6028, 100=0.2552, 250=0.25044, 500=0.2457, 750=0.24097 (USD); Voltage - Working: -; Voltage - Clamping: -; Technology: Mixed Technology; Applications: USB; Package / Case: 6-UFDFN; Supplier Device Package: 6-SON (1.45x1); Packaging: Digi-Reel®; ComponentLink1URL: http://www.ti.com/lit/ds/symlink/tpd4s012.pdf; ComponentLink1Description: http://www.ti.com/lit/ds/symlink/tpd4s012.pdf